# EAGLE design tiny-robot (EAGLE 6.1)
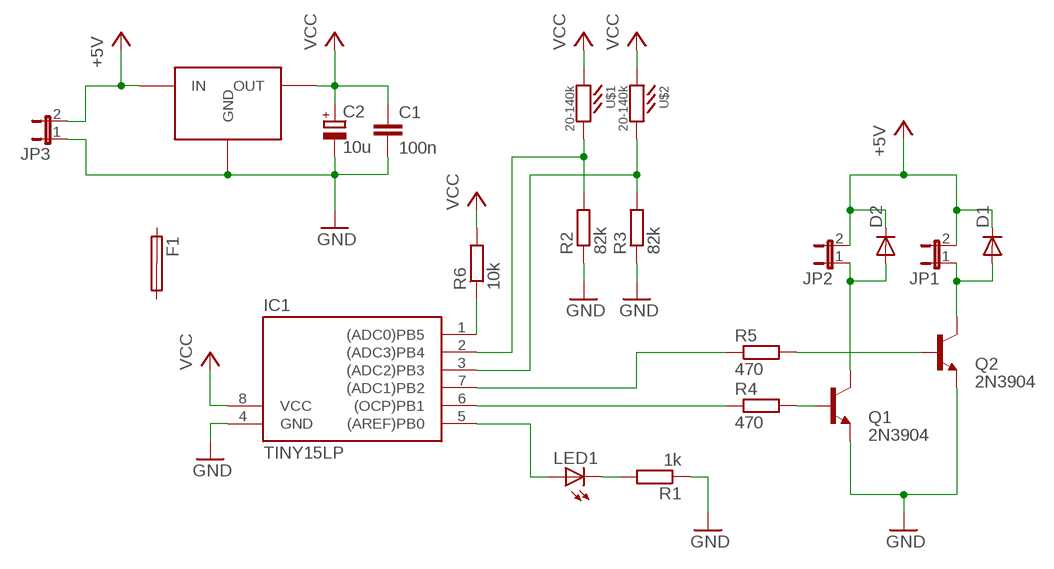
[diagram p0: schematic, sheet 1]

## Parts
C1  100n  C-EU025-025X050  [C025-025X050]
C2  10u  CPOL-EUE2,5-6E  [E2,5-6E]
D1  1N4148DO35-7  [DO35-7]
D2  1N4148DO35-7  [DO35-7]
F1  SHK20L  [SHK20L]
IC1  TINY15LP  [DIL08]
JP1  JP1E  [JP1]
JP2  JP1E  [JP1]
JP3  JP1E  [JP1]
LED1  LED3MM  [LED3MM]
Q1  2N3904  [TO92]
Q2  2N3904  [TO92]
R1  1k  R-EU_0207/2V  [0207/2V]
R2  82k  R-EU_0207/5V  [0207/5V]
R3  82k  R-EU_0207/5V  [0207/5V]
R4  470  R-EU_0207/2V  [0207/2V]
R5  470  R-EU_0207/5V  [0207/5V]
R6  10k  R-EU_0207/5V  [0207/5V]
U$1  20-140k  LDR-906014  [LDR-906014]
U$2  20-140k  LDR-906014  [LDR-906014]
U$3  MCP1700  [TO92]

## Nets
+5V: D1.C D2.C JP1.2 JP2.2 JP3.2 U$3.2(IN)
GND: C1.2 C2.- IC1.4(GND) JP3.1 Q1.3(E) Q2.3(E) R1.1 R2.1 R3.1 U$3.3(GND)
MISO: IC1.6((OCP)PB1) R4.1
MOSI: IC1.5((AREF)PB0) LED1.A
N$2: LED1.K(C) R1.2
N$3: Q1.2(B) R4.2
N$4: Q2.2(B) R5.2
N$11: D2.A JP2.1 Q1.1(C)
N$12: D1.A JP1.1 Q2.1(C)
N$13: IC1.3((ADC2)PB3) R3.2 U$2.P$2
N$15: IC1.2((ADC3)PB4) R2.2 U$1.P$2
RST: IC1.1((ADC0)PB5) R6.1
SCK: IC1.7((ADC1)PB2) R5.1
VCC: C1.1 C2.+ IC1.8(VCC) R6.2 U$1.P$1 U$2.P$1 U$3.1(OUT)
Unconnected: F1.1A F1.1B F1.2A F1.2B

## Library data of the parts
C1 = rcl:C-EU: CAPACITOR, European symbol
C2 = rcl:CPOL-EU: POLARIZED CAPACITOR, European symbol
D1 D2 = diode:1N4148: DIODE high speed (Philips)
F1 = fuse:SHK20L: FUSE HOLDER 5 x 20 mm, SH contact, SHH1 Schukat, E1073 Buerklin
IC1 = atmel:TINY15L: MICROCONTROLLER 2.7 V 1 Kbytes FLASH 64 bytes EEPROM 4-channel 10 bit ADC
JP1-JP3 = jumper:JP1E: JUMPER
LED1 = led:LED: LED OSRAM: - CHIPLED LG R971, LG N971, LY N971, LG Q971, LY Q971, LO R971, LY R971 LH N974, LH R974 LS Q976, LO Q976, LY Q976 LO Q996 - Hyper CHIPLED LW Q18S LB Q993, LB Q99A, LB R99A - SideLED LS A670, LO A670, LY A670, LG A670, LP A670 LB A673, LV A673, LT A673, LW A673 LH A674 LY A675 LS A676, LA A676, LO A676, LY A676, LW A676 LS A679, LY A679, LG A679 - Hyper Micro SIDELED® LS Y876, LA Y876, LO Y876, LY Y876 LT Y87S - SmartLED LW L88C, LW L88S LB L89C, LB L89S, LG L890 LS L89K, LO L89K, LY L89K LS L896, LA L896, LO L896, LY L896 - TOPLED LS T670, LO T670, LY T670, LG T670, LP T670 LSG T670, LSP T670, LSY T670, LOP T670, LYG T670 LG T671, LOG T671, LSG T671 LB T673, LV T673, LT T673, LW T673 LH T674 LS T676, LA T676, LO T676, LY T676, LB T676, LH T676, LSB T676, LW T676 LB T67C, LV T67C, LT T67C, LS T67K, LO T67K, LY T67K, LW E67C LS E67B, LA E67B, LO E67B, LY E67B, LB E67C, LV E67C, LT E67C LW T67C LS T679, LY T679, LG T679 LS T770, LO T770, LY T770, LG T770, LP T770 LB T773, LV T773, LT T773, LW T773 LH T774 LS E675, LA E675, LY E675, LS T675 LS T776, LA T776, LO T776, LY T776, LB T776 LHGB T686 LT T68C, LB T68C - Hyper Mini TOPLED® LB M676 - Mini TOPLED Santana® LG M470 LS M47K, LO M47K, LY M47K Source: http://www.osram.convergy.de LUXEON: - LUMILED® LXK2-PW12-R00, LXK2-PW12-S00, LXK2-PW14-U00, LXK2-PW14-V00 LXK2-PM12-R00, LXK2-PM12-S00, LXK2-PM14-U00 LXK2-PE12-Q00, LXK2-PE12-R00, LXK2-PE12-S00, LXK2-PE14-T00, LXK2-PE14-U00 LXK2-PB12-K00, LXK2-PB12-L00, LXK2-PB12-M00, LXK2-PB14-N00, LXK2-PB14-P00, LXK2-PB14-Q00 LXK2-PR12-L00, LXK2-PR12-M00, LXK2-PR14-Q00, LXK2-PR14-R00 LXK2-PD12-Q00, LXK2-PD12-R00, LXK2-PD12-S00 LXK2-PH12-R00, LXK2-PH12-S00 LXK2-PL12-P00, LXK2-PL12-Q00, LXK2-PL12-R00 Source: www.luxeon.com KINGBRIGHT: KA-3528ASYC Source: www.kingbright.com
Q1 Q2 = transistor-npn:2N3904: NPN Transistor
R1-R6 = rcl:R-EU_: RESISTOR, European symbol
U$1 U$2 = alex:LDR-906014
U$3 = alex:MCP1700

## Board
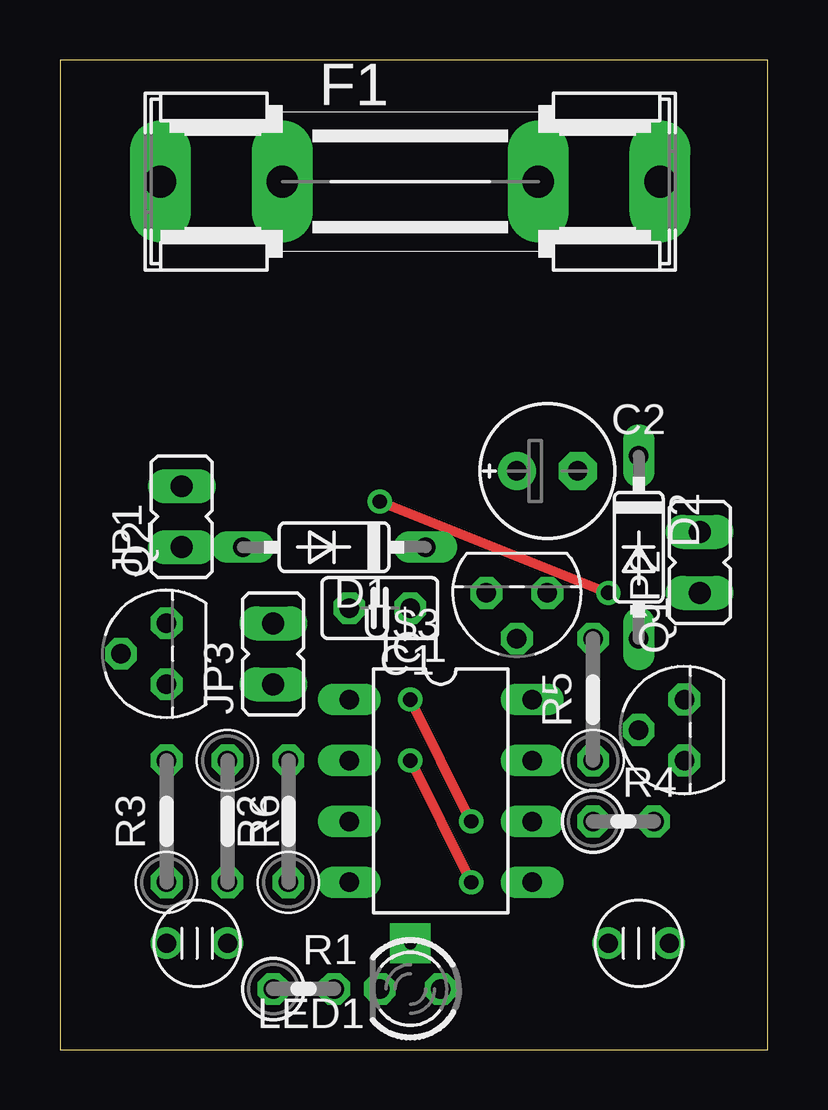
[diagram p1: board, top side]
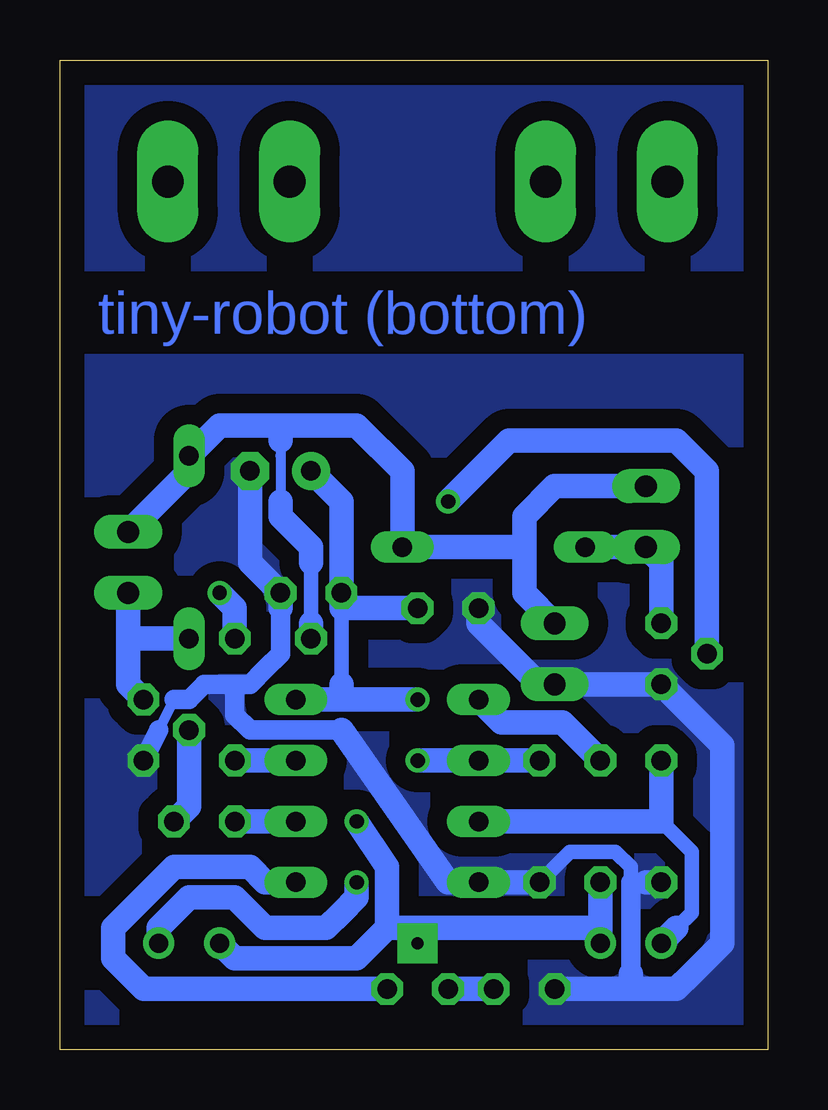
[diagram p2: board, bottom side, seen from below]

Size 29.51 x 41.27 mm. Coordinates in mm from the lower left corner, seen from the top.
Outline: 0,0 29.51,0 29.51,41.27 0,41.27 0,0
Copper layers (1*16): Top 0.035mm / dielectric 1.5mm / Bottom 0.035mm
Design rules: minimum track width 10mil, minimum drill 24mil, track to track 8mil, track to pad 8mil, pad to pad 8mil, via to via 8mil, smd to smd 8mil, copper to edge 40mil, drill to drill 8mil, minimum pad ring 10mil, minimum via ring 8mil, stop-mask expansion 4mil, vias tented up to drill 0mil, thermal gap 10mil

### Footprints (pad centres in the part's own frame; a part is rotated, then mirrored left to right if it is on the bottom)
C025-025X050 = drill 0.813 octagon: 1 -1.27,0; 2 1.27,0
E2,5-6E = drill 0.813 pad 1.575: + -1.27,0 | drill 0.813 pad 1.575 octagon: - 1.27,0
DO35-7 = drill 0.813 long: A 3.81,0; C -3.81,0
SHK20L = drill 1.321 pad 2.54 long: 1A -10.414,0; 1B -5.334,0; 2A 10.414,0; 2B 5.334,0
DIL08 = drill 0.813 long: 1 -3.81,-3.81; 2 -1.27,-3.81; 3 1.27,-3.81; 4 3.81,-3.81; 5 3.81,3.81; 6 1.27,3.81; 7 -1.27,3.81; 8 -3.81,3.81
JP1 = drill 0.914 long: 1 0,-1.27; 2 0,1.27
LED3MM = drill 0.813 octagon: A -1.27,0; K 1.27,0
TO92 = drill 0.813 octagon: 1 1.27,0; 2 0,1.905; 3 -1.27,0
0207/2V = drill 0.813 octagon: 1 -1.27,0; 2 1.27,0
0207/5V = drill 0.813 octagon: 1 -2.54,0; 2 2.54,0
LDR-906014 = drill 0.8 pad 1.27: P$1 0,1.27; P$2 0,-1.27

### Placement (x,y rotation side)
C1  13.34,18.41 180 top
C2  20.32,24.13 0 top
D1  11.43,20.95 180 top
D2  24.13,20.95 270 top
F1  14.61,36.2 0 top
IC1  15.88,10.8 270 top
JP1  5.08,22.23 0 top
JP2  26.67,20.32 0 top
JP3  8.89,16.51 0 top
LED1  14.61,2.54 180 top
Q1  26.04,13.34 90 top
Q2  4.45,16.51 90 top
R1  10.16,2.54 0 top
R2  9.53,9.52 90 top
R3  4.45,9.52 90 top
R4  23.5,9.52 0 top
R5  22.22,14.6 90 top
R6  6.98,9.52 270 top
U$1  24.13,4.45 90 top
U$2  5.71,4.45 270 top
U$3  19.05,19.05 180 top

### Tracks (layer width: path | path; a pad name or v marks a point on that pad's centre or on a via)
+5V
  Bottom 0.406: 20.32,22.86 20.32,24.77 20.32,25.4
  Bottom 0.61: 19.05,17.78 19.05,18.41 19.05,19.68 19.05,20.32
  Bottom 1.016: JP2.2 24.13,24.13 D2.C 22.86,26.03 20.32,26.03 | 20.32,26.03 17.14,26.03 15.24,24.13 D1.C | 19.05,17.78 U$3.2 | 19.05,20.32 19.05,20.95 20.32,22.23 20.32,22.86 | 20.32,26.03 20.32,25.4 | D1.C 14.61,20.95 | D1.C 14.61,20.95 | D1.C 14.61,20.95 | JP3.2 10.16,19.05 10.16,20.95 | 10.16,20.95 10.16,22.23 8.89,23.49 JP1.2 | 10.16,20.95 D1.C
GND
  Bottom 0.406: 24.76,14.6 25.4,13.34
  Bottom 0.61: R2.1 8.25,8.25 6.35,8.25 5.71,7.62 5.71,6.98 5.08,6.98
  Bottom 0.813: 25.4,13.34 Q1.3 | 20.32,18.41 20.32,17.78 20.32,16.51 20.96,15.88 21.59,15.24 22.22,15.24 | 5.71,3.17 5.71,6.98 | 22.22,15.24 22.22,14.6 22.22,13.97 21.59,13.34 20.96,13.34 17.78,13.34 | 22.22,15.24 23.5,15.24 24.13,14.6 24.76,14.6
  Bottom 1.016: IC1.4 R2.1 IC1.4 | C2.- 21.59,20.32 U$3.3 20.32,18.41 | IC1.4 13.34,6.98 17.78,13.34 | 5.08,6.98 R3.1 | 5.08,2.54 3.81,2.54 3.18,3.17 1.91,4.45 1.91,5.08 1.91,12.7 Q2.3 JP3.1 9.53,15.24 10.8,16.51 12.07,17.78 C1.2 | 5.08,2.54 5.71,2.54 | 5.71,2.54 R1.1 5.71,2.54 | 5.08,2.54 5.71,2.54 | 5.71,2.54 5.71,3.17
  pour Bottom (isolate 0.813, no thermals): 0,41.27 29.85,41.27 29.85,0 0,0
MISO
  Bottom 1.016: IC1.6 R4.1
MOSI
  Bottom 1.016: LED1.A 19.68,2.54 26.04,2.54 27.31,3.81 27.31,5.08 24.76,7.62 21.59,7.62 20.96,6.98 IC1.5
N$2
  Bottom 1.016: R1.2 LED1.K
N$3
  Bottom 1.016: Q1.2 24.13,11.43 24.13,10.16 R4.2
N$4  (via drill 0.6)
  Top 0.406: v13.34,22.86 v22.86,19.05
  Bottom 1.016: R5.2 22.22,18.41 v22.86,19.05 | v13.34,22.86 10.8,25.4 3.81,25.4 2.54,24.13 Q2.2
N$11
  Bottom 1.016: 26.67,17.14 26.67,15.24 Q1.1 | 26.67,17.14 JP2.1 | D2.A 26.67,17.14
N$12
  Bottom 1.016: D1.A JP1.1 4.45,20.32 Q2.1
N$13
  Bottom 0.61: 4.45,9.52 3.18,8.25 3.18,5.71 3.81,5.08
  Bottom 1.016: IC1.3 4.45,9.52 R3.2 | U$2.P$2 3.81,5.08
N$15  (via drill 0.6)
  Top 0.406: v14.61,12.06 v17.14,6.98
  Bottom 1.016: R2.2 IC1.2 v14.61,12.06 | v17.14,6.98 17.14,6.35 17.78,5.71 18.42,5.08 20.96,5.08 21.59,5.71 22.22,6.35 24.13,6.35 25.4,5.08 U$1.P$2
RST
  Bottom 1.016: R6.1 8.25,13.34 8.57,13.65 10.8,13.65 11.11,13.65 IC1.1
SCK
  Bottom 1.016: IC1.7 R5.1
VCC  (via drill 0.5 pad 1.68, 0.6)
  Top 0.406: v17.14,9.52 v14.61,14.6
  Bottom 0.61: 17.78,15.24 17.78,18.41
  Bottom 1.016: 6.98,5.08 U$2.P$1 6.98,5.08 | 6.98,5.08 R6.2 6.98,5.08 | C2.+ 17.78,22.86 U$3.1 17.78,18.41 C1.1 | 17.78,14.6 17.78,15.24 | 17.78,14.6 IC1.8 | v17.14,9.52 15.88,7.62 15.88,5.08 | v14.61,14.6 17.78,14.6 | 6.98,5.08 13.97,5.08 14.61,5.08 | 14.61,5.08 15.24,5.08 15.88,5.08 | 15.88,5.08 17.14,3.81 20.32,3.81 22.22,3.81 U$1.P$1 | 14.61,5.08 v14.61,4.45

### Text on the board
Bottom: tiny-robot (bottom)